# EAGLE design G021K (EAGLE 6.6.0)
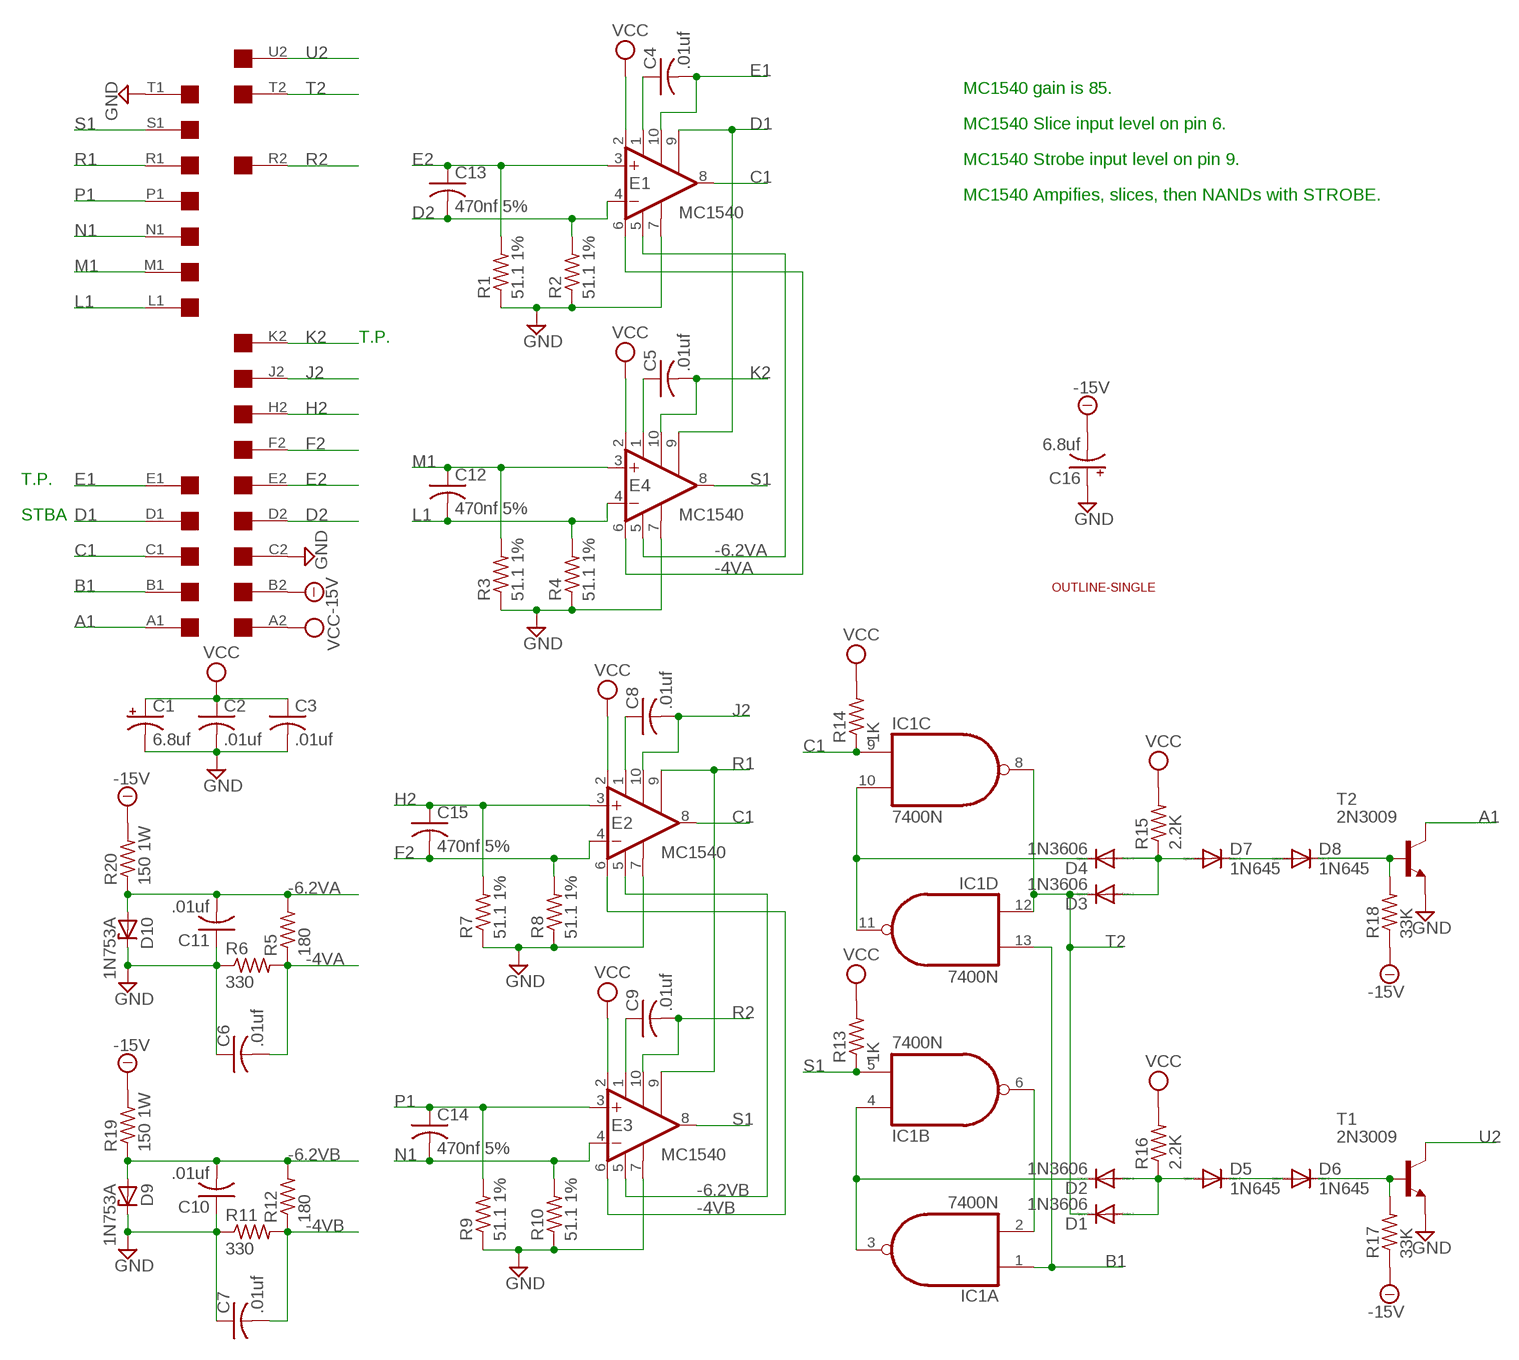
[diagram p0: schematic, sheet 1]

## Parts
C1  6.8uf  CPOL-USE22-6AXIAL  [E22-6]
C2  .01uf  C-US050-025X075  [C050-025X075]
C3  .01uf  C-US050-025X075  [C050-025X075]
C4  .01uf  C-US050-025X075  [C050-025X075]
C5  .01uf  C-US050-025X075  [C050-025X075]
C6  .01uf  C-US050-025X075  [C050-025X075]
C7  .01uf  C-US050-025X075  [C050-025X075]
C8  .01uf  C-US050-025X075  [C050-025X075]
C9  .01uf  C-US050-025X075  [C050-025X075]
C10  .01uf  C-US050-025X075  [C050-025X075]
C11  .01uf  C-US050-025X075  [C050-025X075]
C12  470nf 5%  C-US050-025X075  [C050-025X075]
C13  470nf 5%  C-US050-025X075  [C050-025X075]
C14  470nf 5%  C-US050-025X075  [C050-025X075]
C15  470nf 5%  C-US050-025X075  [C050-025X075]
C16  6.8uf  CPOL-USE22-6AXIAL  [E22-6]
D1  1N3606  1N4148DO35-10  [DO35-10]
D2  1N3606  1N4148DO35-10  [DO35-10]
D3  1N3606  1N4148DO35-10  [DO35-10]
D4  1N3606  1N4148DO35-10  [DO35-10]
D5  1N645  1N4148DO35-10  [DO35-10]
D6  1N645  1N4148DO35-10  [DO35-10]
D7  1N645  1N4148DO35-10  [DO35-10]
D8  1N645  1N4148DO35-10  [DO35-10]
D9  1N753A  ZENER-DIODEF126-10  [F126Z10]
D10  1N753A  ZENER-DIODEF126-10  [F126Z10]
E1  MC1540  MC1540G  [602B]
E2  MC1540  MC1540G  [602B]
E3  MC1540  MC1540G  [602B]
E4  MC1540  MC1540G  [602B]
IC1  7400N  [DIL14]
R1  51.1 1%  R-US_0207/10  [0207/10]
R2  51.1 1%  R-US_0207/10  [0207/10]
R3  51.1 1%  R-US_0207/10  [0207/10]
R4  51.1 1%  R-US_0207/10  [0207/10]
R5  180  R-US_0207/10  [0207/10]
R6  330  R-US_0207/10  [0207/10]
R7  51.1 1%  R-US_0207/10  [0207/10]
R8  51.1 1%  R-US_0207/10  [0207/10]
R9  51.1 1%  R-US_0207/10  [0207/10]
R10  51.1 1%  R-US_0207/10  [0207/10]
R11  330  R-US_0207/10  [0207/10]
R12  180  R-US_0207/10  [0207/10]
R13  1K  R-US_0207/10  [0207/10]
R14  1K  R-US_0207/10  [0207/10]
R15  2.2K  R-US_0207/10  [0207/10]
R16  2.2K  R-US_0207/10  [0207/10]
R17  33K  R-US_0207/10  [0207/10]
R18  33K  R-US_0207/10  [0207/10]
R19  150 1W  R-US_0414/15  [0414/15]
R20  150 1W  R-US_0414/15  [0414/15]
T1  2N3009  2N3565  [TO92]
T2  2N3009  2N3565  [TO92]
U$1  SINGLE  [EDGE-CON2]
U$2  OUTLINE-SINGLE  [SINGLE]

## Nets
-4VA: C6.2 E1.6(SLICE) E4.6(SLICE) R5.1 R6.2
-4VB: C7.2 E2.6(SLICE) E3.6(SLICE) R11.2 R12.1
-6.2VA: C11.2 D10.A E1.5(V-) E4.5(V-) R5.2 R20.1
-6.2VB: C10.2 D9.A E2.5(V-) E3.5(V-) R12.2 R19.1
-15V: C16.- R17.1 R18.1 R19.2 R20.2 U$1.B2
A1: T2.1(C) U$1.A1
B1: IC1.1(A:I0) IC1.13(D:I1) U$1.B1
C1: E1.8(OUT) E2.8(OUT) IC1.9(C:I0) R14.1 U$1.C1
D1: E1.9(ISTROBE) E4.9(ISTROBE) U$1.D1
D2: C13.2 E1.4(-IN) R2.2 U$1.D2
E1: C4.2 E1.10(CEXTB) U$1.E1
E2: C13.1 E1.3(+IN) R1.2 U$1.E2
F2: C15.2 E2.4(-IN) R8.2 U$1.F2
GND: C1.- C2.2 C3.2 C6.1 C7.1 C10.1 C11.1 C16.+ D9.C D10.C E1.7(GND) E2.7(GND) E3.7(GND) E4.7(GND) R1.1 R2.1 R3.1 R4.1 R6.1 R7.1 R8.1 R9.1 R10.1 R11.1 T1.3(E) T2.3(E) U$1.C2 U$1.T1
H2: C15.1 E2.3(+IN) R7.2 U$1.H2
J2: C8.2 E2.10(CEXTB) U$1.J2
K2: C5.2 E4.10(CEXTB) U$1.K2
L1: C12.2 E4.4(-IN) R4.2 U$1.L1
M1: C12.1 E4.3(+IN) R3.2 U$1.M1
N1: C14.2 E3.4(-IN) R10.2 U$1.N1
N$1: C4.1 E1.1(CEXTA)
N$2: C8.1 E2.1(CEXTA)
N$3: C5.1 E4.1(CEXTA)
N$4: C9.1 E3.1(CEXTA)
N$6: D1.A D2.A D5.A R16.1
N$7: D4.C IC1.10(C:I1) IC1.11(D:O)
N$8: D2.C IC1.3(A:O) IC1.4(B:I0)
N$9: IC1.2(A:I1) IC1.6(B:O)
N$10: D3.A D4.A D7.A R15.1
N$11: D7.C D8.A
N$12: D5.C D6.A
N$13: D8.C R18.2 T2.2(B)
N$14: D6.C R17.2 T1.2(B)
P1: C14.1 E3.3(+IN) R9.2 U$1.P1
R1: E2.9(ISTROBE) E3.9(ISTROBE) U$1.R1
R2: C9.2 E3.10(CEXTB) U$1.R2
S1: E3.8(OUT) E4.8(OUT) IC1.5(B:I1) R13.1 U$1.S1
T2: D1.C D3.C IC1.8(C:O) IC1.12(D:I0) U$1.T2
U2: T1.1(C) U$1.U2
VCC: C1.+ C2.1 C3.1 E1.2(V+) E2.2(V+) E3.2(V+) E4.2(V+) R13.2 R14.2 R15.2 R16.2 U$1.A2
Unconnected: U$1.F1 U$1.H1 U$1.J1 U$1.K1 U$1.L2 U$1.M2 U$1.N2 U$1.P2 U$1.S2 U$1.U1 U$1.V1 U$1.V2

## Notes on the sheet
- MC1540 gain is 85.
- MC1540 Slice input level on pin 6.
- MC1540 Strobe input level on pin 9.
- MC1540 Ampifies, slices, then NANDs with STROBE.
- T.P.
- T.P.
- STBA

## Power pins joined to a net without a drawn wire
GND: IC1.7(P:GND)
VCC: IC1.14(P:VCC)

## Library data of the parts
C1 C16 = rcl:CPOL-US: POLARIZED CAPACITOR, American symbol
C2-C15 = rcl:C-US: CAPACITOR, American symbol
D1-D8 = diode:1N4148: DIODE high speed (Philips)
D9 D10 = diode:ZENER-DIODE: Z-Diode
E1-E4 = dec-con:MC1540: OP AMP
IC1 = 74xx-us:74*00: Quad 2-input NAND gate
R1-R20 = rcl:R-US_: RESISTOR, American symbol
T1 T2 = transistor:2N3565: NPN TRANSISTOR
U$1 = dec-con:SINGLE: Single-Height DEC board
U$2 = dec-con:OUTLINE-*: Board outlines for DEC boards.

## Board
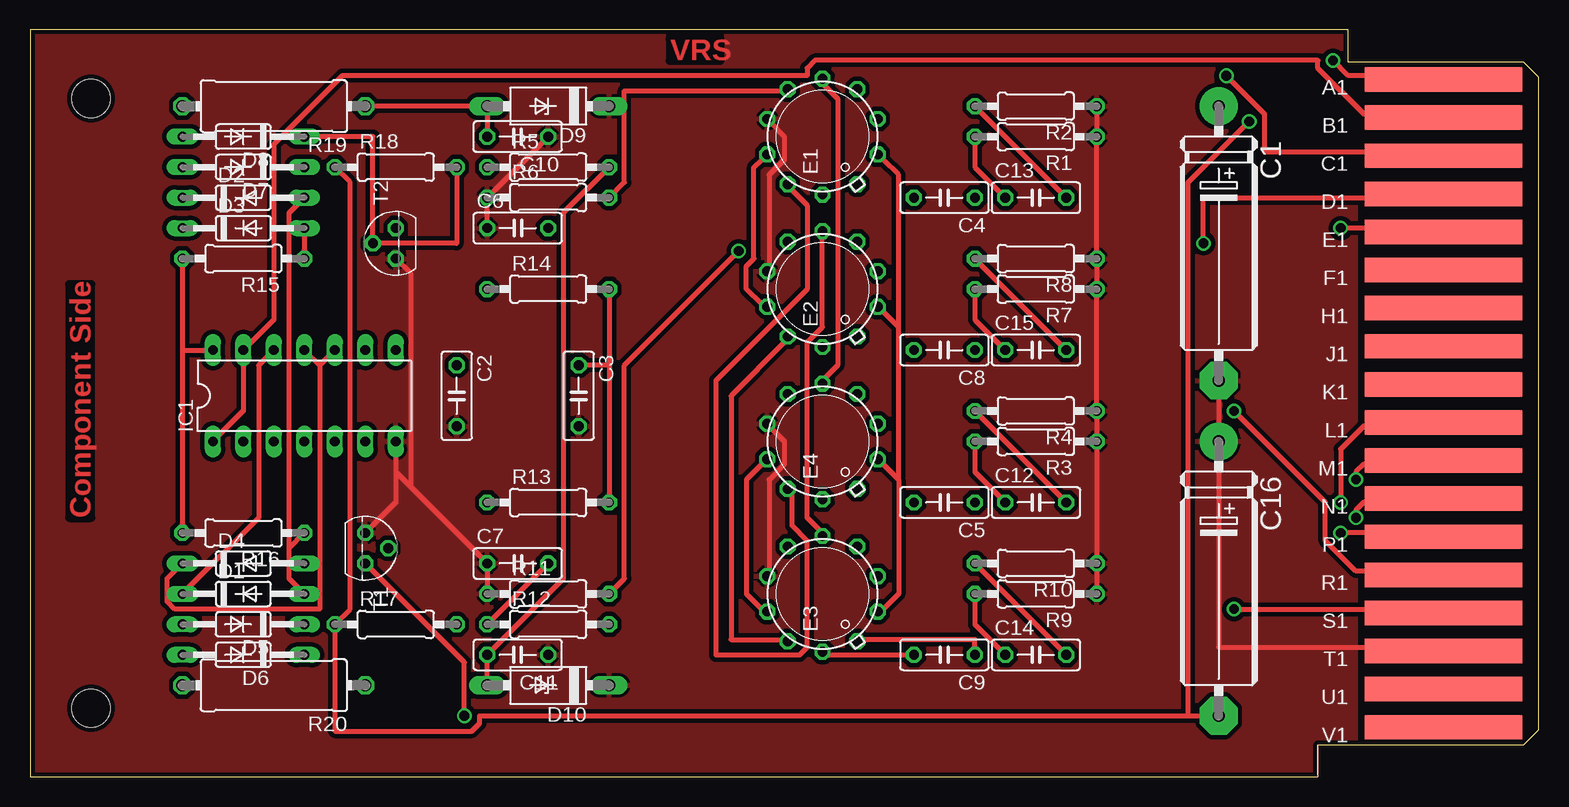
[diagram p1: board, top side]
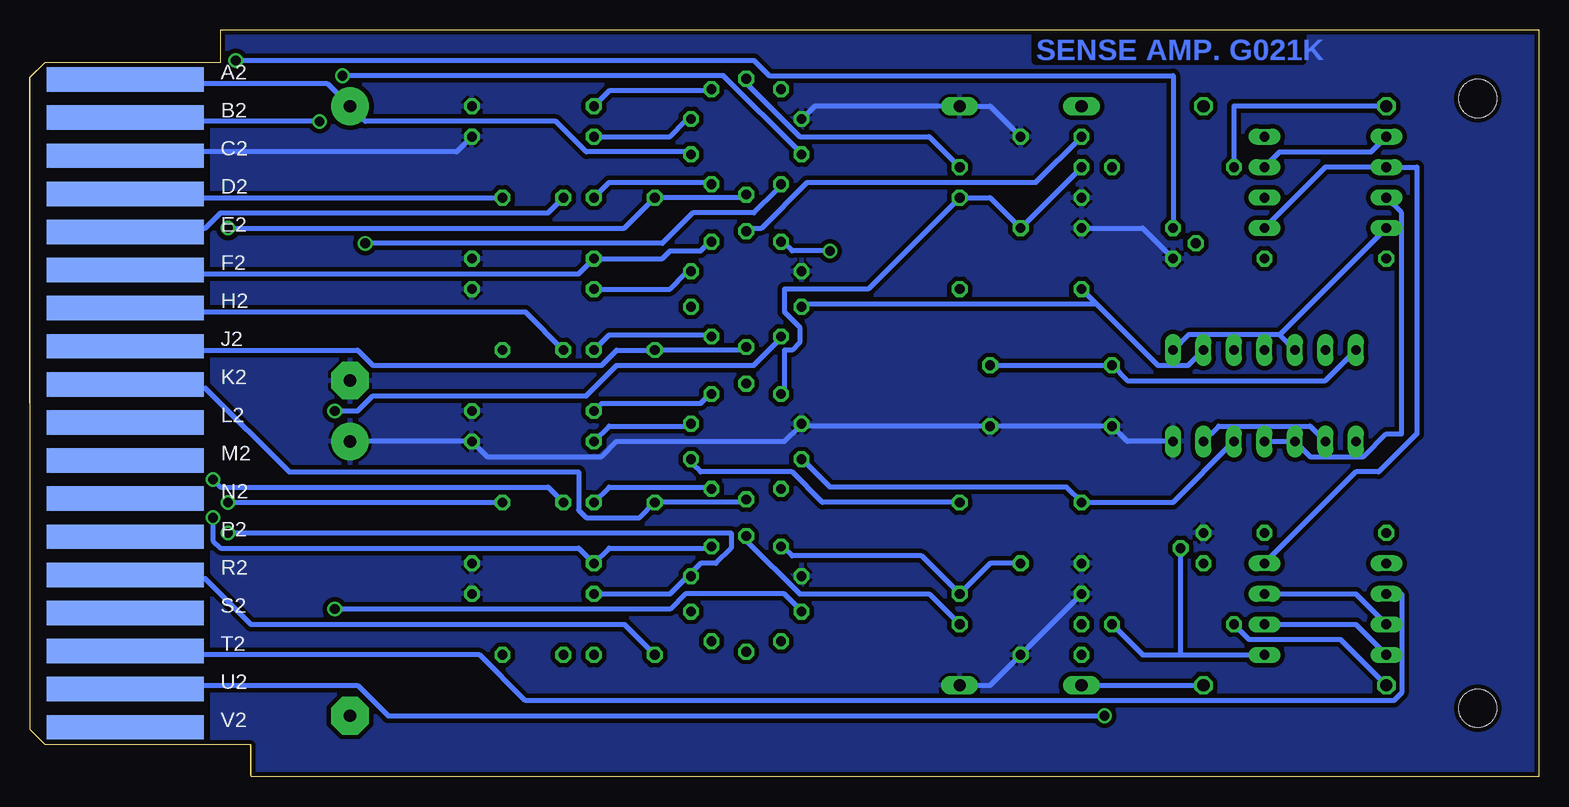
[diagram p2: board, bottom side, seen from below]

Size 125.73 x 62.23 mm. Coordinates in mm from the lower left corner, seen from the top.
Copper layers (1+16): Top 0.035mm / dielectric 1.5mm / Bottom 0.035mm
Design rules "16mils": minimum track width 16mil, minimum drill 32mil, track to track 15mil, track to pad 10mil, pad to pad 10mil, via to via 10mil, smd to smd 10mil, copper to edge 13mil, drill to drill 10mil, minimum pad ring 10mil, minimum via ring 8mil, stop-mask expansion 0mil, vias tented up to drill 0mil, thermal gap 10mil

### Footprints (pad centres in the part's own frame; a part is rotated, then mirrored left to right if it is on the bottom)
E22-6 = drill 1.016 pad 3.15: + -11.43,0 | drill 1.016 pad 3.15 octagon: - 11.43,0
C050-025X075 = drill 0.813 octagon: 1 -2.54,0; 2 2.54,0
DO35-10 = drill 0.813 long: A 5.08,0; C -5.08,0
F126Z10 = drill 1.016 long: A 5.08,0; C -5.08,0
602B = drill 0.813 octagon: 1 -3.954,-2.897; 2 -1.478,-4.605; 3 1.478,-4.605; 4 3.954,-2.897; 5 4.825,0; 6 3.954,2.897; 7 1.478,4.605; 8 -1.477,4.605; 9 -3.954,2.897; 10 -4.825,0
DIL14 = drill 0.813 long: 1 -7.62,-3.81; 2 -5.08,-3.81; 3 -2.54,-3.81; 4 0,-3.81; 5 2.54,-3.81; 6 5.08,-3.81; 7 7.62,-3.81; 8 7.62,3.81; 9 5.08,3.81; 10 2.54,3.81; 11 0,3.81; 12 -2.54,3.81; 13 -5.08,3.81; 14 -7.62,3.81
0207/10 = drill 0.813 octagon: 1 -5.08,0; 2 5.08,0
0414/15 = drill 1.016 octagon: 1 -7.62,0; 2 7.62,0
TO92 = drill 0.813 octagon: 1 1.27,0; 2 0,1.905; 3 -1.27,0
EDGE-CON2 = smd 13.106 x 2.032: A1 7.938,4.128; B1 7.938,7.303; C1 7.938,10.477; D1 7.938,13.652; E1 7.938,16.828; F1 7.938,20.003; H1 7.938,23.177; J1 7.938,26.352; K1 7.938,29.527; L1 7.938,32.703; M1 7.938,35.877; N1 7.938,39.053; P1 7.938,42.227; R1 7.938,45.403; S1 7.938,48.578; T1 7.938,51.752; U1 7.938,54.928; V1 7.938,58.102 | smd 13.106 x 2.032 bottom: A2 7.938,4.128; B2 7.938,7.303; C2 7.938,10.477; D2 7.938,13.652; E2 7.938,16.828; F2 7.938,20.003; H2 7.938,23.177; J2 7.938,26.352; K2 7.938,29.527; L2 7.938,32.703; M2 7.938,35.877; N2 7.938,39.053; P2 7.938,42.227; R2 7.938,45.403; S2 7.938,48.578; T2 7.938,51.752; U2 7.938,54.928; V2 7.938,58.102
SINGLE = hole 3.175: 120.65,56.515; 120.65,5.715

### Placement (x,y rotation side)
C1  99.06,44.45 270 top
C2  35.56,31.75 270 top
C3  45.72,31.75 270 top
C4  76.2,48.26 180 top
C5  76.2,22.86 180 top
C6  40.64,45.72 0 top
C7  40.64,17.78 0 top
C8  76.2,35.56 180 top
C9  76.2,10.16 180 top
C10  40.64,53.34 180 top
C11  40.64,10.16 180 top
C12  83.82,22.86 0 top
C13  83.82,48.26 0 top
C14  83.82,10.16 0 top
C15  83.82,35.56 0 top
C16  99.06,16.51 270 top
D1  17.78,15.24 0 top
D2  17.78,48.26 0 top
D3  17.78,45.72 0 top
D4  17.78,17.78 0 top
D5  17.78,12.7 180 top
D6  17.78,10.16 180 top
D7  17.78,50.8 180 top
D8  17.78,53.34 180 top
D9  43.18,55.88 180 top
D10  43.18,7.62 180 top
E1  66.04,53.34 90 top
E2  66.04,40.64 90 top
E3  66.04,15.24 90 top
E4  66.04,27.94 90 top
IC1  22.86,31.75 0 top
R1  83.82,53.34 180 top
R2  83.82,55.88 180 top
R3  83.82,27.94 180 top
R4  83.82,30.48 180 top
R5  43.18,50.8 0 top
R6  43.18,48.26 0 top
R7  83.82,40.64 180 top
R8  83.82,43.18 180 top
R9  83.82,15.24 180 top
R10  83.82,17.78 180 top
R11  43.18,15.24 0 top
R12  43.18,12.7 0 top
R13  43.18,22.86 0 top
R14  43.18,40.64 0 top
R15  17.78,43.18 180 top
R16  17.78,20.32 180 top
R17  30.48,12.7 0 top
R18  30.48,50.8 0 top
R19  20.32,55.88 180 top
R20  20.32,7.62 180 top
T1  27.94,19.05 270 top
T2  30.48,44.45 90 top
U$1  125.73,62.23 180 top
U$2  125.73,62.23 180 top

### Tracks (layer width: path | path; a pad name or v marks a point on that pad's centre or on a via)
-4VA
  Top 0.406: R6.2 49.53,49.53 49.53,57.15 62.87,57.15 E1.6
  Bottom 0.406: R5.1 C6.2 45.72,48.26 R6.2 55.88,40.64 62.87,40.64 62.87,38.73 61.59,37.47 61.59,36.2 62.23,35.56 62.87,35.56 62.87,32.38 E4.6
-4VB  (via drill 0.81)
  Top 0.406: C7.2 R12.1 | v59.05,43.81 49.53,34.29 49.53,16.51 R11.2
  Bottom 0.406: C7.2 45.72,17.78 R11.2 51.44,18.41 62.23,18.41 62.87,19.05 E3.6 | v59.05,43.81 62.23,43.81 62.87,44.45 E2.6
-6.2VA
  Top 0.406: D10.A C11.2 44.45,16.51 44.45,46.99 R5.2 | E4.5 66.04,33.02 67.31,34.29 67.31,56.52 66.04,57.78 E1.5
  Bottom 0.406: D10.A R20.1 | R5.2 50.8,53.34 61.59,53.34 66.04,57.78 E1.5
-6.2VB
  Top 0.406: C10.2 D9.A R19.1 | E2.5 66.04,37.47 64.77,36.2 64.77,21.59 66.04,20.32 E3.5
  Bottom 0.406: R12.2 50.8,15.24 61.59,15.24 66.04,19.68 E3.5 | C10.2 41.91,49.53 60.96,49.53 64.77,45.72 66.04,45.72 E2.5
-15V  (via drill 0.81)
  Top 0.406: 96.52,5.08 37.47,5.08 37.47,4.45 36.83,3.81 25.4,3.81 R17.1 26.67,13.97 26.67,49.53 R18.1 | 96.52,5.08 C16.- | v101.6,54.61 96.52,49.53 96.52,5.08
  Bottom 0.406: R18.1 25.4,55.88 R19.2 | R17.1 24.13,11.43 16.51,11.43 R20.2 | v101.6,54.61 117.47,54.61 U$1.B2
A1  (via drill 0.81)
  Top 0.406: v108.58,59.69 109.86,58.42 117.47,58.42 U$1.A1
  Bottom 0.406: T2.1 30.48,58.42 64.14,58.42 65.41,59.69 v108.58,59.69
B1
  Top 0.406: IC1.1 17.78,30.48 IC1.13 20.32,38.1 20.32,52.7 26.04,58.42 64.77,58.42 64.77,59.05 65.41,59.69 107.31,59.69 107.31,59.05 111.12,55.24 117.47,55.24 U$1.B1
C1  (via drill 0.81)
  Top 0.406: E1.8 60.96,51.44 60.33,50.8 60.33,43.18 59.69,42.55 59.69,40.64 60.96,39.37 E2.8 | v99.69,58.42 102.87,55.24 102.87,52.07 117.47,52.07 U$1.C1
  Bottom 0.406: IC1.9 29.21,34.29 31.75,34.29 36.83,39.37 | R14.1 36.83,39.37 | 36.83,39.37 60.96,39.37 E2.8 | v99.69,58.42 67.94,58.42 61.59,52.07 E1.8
D1  (via drill 0.81)
  Top 0.406: E4.9 63.5,23.5 63.5,20.95 64.77,19.68 64.77,10.79 64.14,10.16 57.15,10.16 57.15,33.02 64.77,40.64 64.77,47.62 63.5,48.9 E1.9 | v97.79,44.45 97.79,48.26 117.47,48.26 U$1.D1
  Bottom 0.406: v97.79,44.45 73.03,44.45 70.48,46.99 65.41,46.99 63.5,48.9 E1.9
D2
  Top 0.406: R2.2 C13.2
  Bottom 0.406: R2.2 77.47,57.15 69.22,57.15 E1.4 | C13.2 117.47,48.26 U$1.D2
E1  (via drill 0.81)
  Top 0.406: v109.22,45.72 117.47,45.72 U$1.E1
  Bottom 0.406: E1.10 66.04,48.26 C4.2 76.2,45.72 v109.22,45.72
E2
  Top 0.406: C13.1 78.74,50.8 R1.2
  Bottom 0.406: R1.2 72.39,53.34 71.12,54.61 E1.3 | C13.1 82.55,46.99 109.86,46.99 111.12,45.72 117.47,45.72 U$1.E2
F2
  Top 0.406: R8.2 C15.2
  Bottom 0.406: E2.4 69.22,44.45 69.85,43.81 72.39,43.81 73.03,43.18 R8.2 80.01,41.91 117.47,41.91 U$1.F2
GND
  Top 0.406: E2.7 61.59,42.55 61.59,50.16 62.87,51.44 62.87,53.34 61.59,54.61 E1.7 | C6.1 R6.1 C10.1 | R11.1 C7.1 31.75,24.13 | E3.7 61.59,17.14 61.59,24.77 62.87,26.04 62.87,27.94 61.59,29.21 E4.7 | T1.3 30.48,22.86 30.48,25.4 | IC1.7 30.48,25.4 | 30.48,25.4 31.75,24.13 | T2.3 31.75,41.91 31.75,24.13 | C1.- C16.+ 99.06,10.79 117.47,10.79 U$1.T1 | R2.1 R1.1 R8.1 R7.1 R4.1 R3.1 R10.1 R9.1
  Bottom 0.406: C10.1 45.72,55.88 D9.C 60.33,55.88 60.96,55.24 E1.7 | T2.3 33.02,45.72 C6.1 | D10.C 45.72,7.62 C11.1 R11.1 | IC1.7 34.29,27.94 C2.2 C3.2 60.96,29.21 E4.7 61.59,29.21 62.87,27.94 76.83,27.94 78.11,26.67 87.63,26.67 R3.1 C16.+ | R1.1 90.17,52.07 117.47,52.07 U$1.C2
  pour Top (isolate 0.381): 0,0 110.11,0 110.49,0.38 110.49,62.23 0.38,62.23 0,61.85
  pour Bottom (isolate 0.381): 0,0 110.11,0 110.49,0.38 110.49,62.23 0.38,62.23 0,61.85
H2
  Top 0.406: C15.1 78.74,38.1 R7.2
  Bottom 0.406: R7.2 72.39,40.64 71.12,41.91 E2.3 | C15.1 84.45,38.73 117.47,38.73 U$1.H2
J2
  Bottom 0.406: E2.10 66.04,35.56 C8.2 76.83,35.56 78.11,34.29 97.16,34.29 98.42,35.56 117.47,35.56 U$1.J2
K2
  Bottom 0.406: E4.10 66.04,22.86 C5.2 74.93,21.59 79.38,21.59 80.01,22.23 80.01,25.4 104.14,25.4 111.12,32.38 117.47,32.38 U$1.K2
L1  (via drill 0.81)
  Top 0.406: R4.2 C12.2 | v109.22,22.86 109.22,27.3 111.12,29.21 117.47,29.21 U$1.L1
  Bottom 0.406: R4.2 78.11,31.11 69.85,31.11 69.22,31.75 E4.4 | v109.22,22.86 C12.2
M1  (via drill 0.81)
  Top 0.406: C12.1 78.74,25.4 R3.2 | v110.49,24.77 110.49,25.4 111.12,26.04 117.47,26.04 U$1.M1
  Bottom 0.406: R3.2 77.47,29.21 71.12,29.21 E4.3 | C12.1 82.55,24.13 109.86,24.13 v110.49,24.77
N1  (via drill 0.81)
  Top 0.406: R10.2 C14.2 | v110.49,21.59 110.49,22.23 111.12,22.86 117.47,22.86 U$1.N1
  Bottom 0.406: E3.4 69.22,19.05 77.47,19.05 R10.2 80.01,19.05 109.86,19.05 110.49,19.68 v110.49,21.59
N$1
  Bottom 0.406: C4.1 77.47,49.53 69.22,49.53 E1.1
N$2
  Bottom 0.406: C8.1 77.47,36.83 69.22,36.83 E2.1
N$3
  Bottom 0.406: C5.1 77.47,24.13 69.22,24.13 E4.1
N$4
  Top 0.406: C9.1 78.74,11.43 69.22,11.43 E3.1
N$6
  Top 0.406: 21.59,19.05 R16.1 | 21.59,19.05 21.59,16.51 D1.A | D2.A 21.59,46.99 21.59,19.05
  Bottom 0.406: D5.A 15.24,15.24 D1.A
N$7
  Top 0.406: D4.C 11.43,16.51 11.43,14.61 12.06,13.97 24.13,13.97 24.13,34.29 | IC1.11 24.13,34.29 | 24.13,34.29 IC1.10
N$8
  Bottom 0.406: IC1.4 IC1.3 19.05,26.67 14.61,26.67 12.7,28.57 11.43,28.57 11.43,46.99 D2.C
N$9
  Bottom 0.406: IC1.2 19.05,29.21 26.67,29.21 IC1.6
N$10
  Top 0.406: D3.A R15.1
  Bottom 0.406: D4.A 15.24,25.4 13.34,25.4 10.16,28.57 10.16,50.8 D7.A 17.78,50.8 D3.A
N$11
  Bottom 0.406: D8.A 13.97,52.07 21.59,52.07 D7.C
N$12
  Bottom 0.406: D6.A 15.24,12.7 D5.C
N$13
  Top 0.406: R18.2 35.56,44.45 T2.2 28.57,53.34 D8.C
N$14
  Bottom 0.406: 29.84,10.16 33.02,10.16 R17.2 | 29.84,10.16 D6.C | 29.84,10.16 T1.2
P1  (via drill 0.81)
  Top 0.406: C14.1 78.74,12.7 R9.2 | v109.22,20.32 117.47,20.32 U$1.P1
  Bottom 0.406: R9.2 72.39,15.24 71.12,16.51 E3.3 70.48,17.14 69.85,17.78 68.58,17.78 67.31,19.05 67.31,20.32 v109.22,20.32
R1  (via drill 0.81)
  Top 0.406: E3.9 62.87,11.43 58.42,11.43 58.42,31.75 62.87,36.2 E2.9 | v100.33,30.48 107.95,22.86 107.95,19.68 110.49,17.14 117.47,17.14 U$1.R1
  Bottom 0.406: v100.33,30.48 98.42,30.48 97.16,31.75 79.38,31.75 76.83,34.29 65.41,34.29 63.5,36.2 E2.9
R2
  Top 0.406: C9.2 66.04,10.16 E3.10
  Bottom 0.406: C9.2 76.2,12.7 107.31,12.7 111.12,16.51 117.47,16.51 U$1.R2
S1  (via drill 0.81)
  Top 0.406: E3.8 60.96,13.97 59.69,15.24 59.69,24.77 60.96,26.04 E4.8 | v100.33,13.97 117.47,13.97 U$1.S1
  Bottom 0.406: IC1.5 30.48,22.86 R13.1 39.37,24.13 59.05,24.13 60.96,26.04 E4.8 | v100.33,13.97 72.39,13.97 71.12,15.24 62.87,15.24 61.59,13.97 E3.8
T2
  Top 0.406: D1.C 19.05,21.59 19.05,34.29 IC1.12
  Bottom 0.406: IC1.8 29.21,36.83 21.59,36.83 | IC1.12 21.59,36.83 | 21.59,36.83 D3.C | D1.C 11.43,15.24 11.43,6.99 12.06,6.35 84.45,6.35 88.27,10.16 117.47,10.16 U$1.T2
U2  (via drill 0.81)
  Top 0.406: T1.1 36.2,9.53 v36.2,5.08
  Bottom 0.406: v36.2,5.08 95.89,5.08 98.42,7.62 117.47,7.62 U$1.U2
VCC
  Top 0.406: 72.39,24.77 72.39,15.24 71.12,13.97 E3.2 | 72.39,24.77 71.12,26.04 E4.2 | 72.39,37.47 71.12,38.73 E2.2 | 72.39,24.77 72.39,37.47 | 72.39,37.47 72.39,50.16 71.12,51.44 E1.2 | R15.2 12.7,35.56 | 12.7,35.56 R16.2 | 12.7,35.56 IC1.14 | R14.2 48.26,34.29 | 48.26,34.29 R13.2 | 48.26,34.29 C3.1
  Bottom 0.406: U$1.A2 117.47,57.78 100.97,57.78 C1.+ 97.79,54.61 81.92,54.61 79.38,52.07 71.12,52.07 E1.2 | C3.1 C2.1 34.29,33.02 17.78,33.02 IC1.14 | R13.2 59.69,22.86 62.23,25.4 69.85,25.4 70.48,26.04 E4.2

### Text on the board
Top: VRS | Component Side
Bottom: SENSE AMP. G021K
Document: Layout is based on G021H.